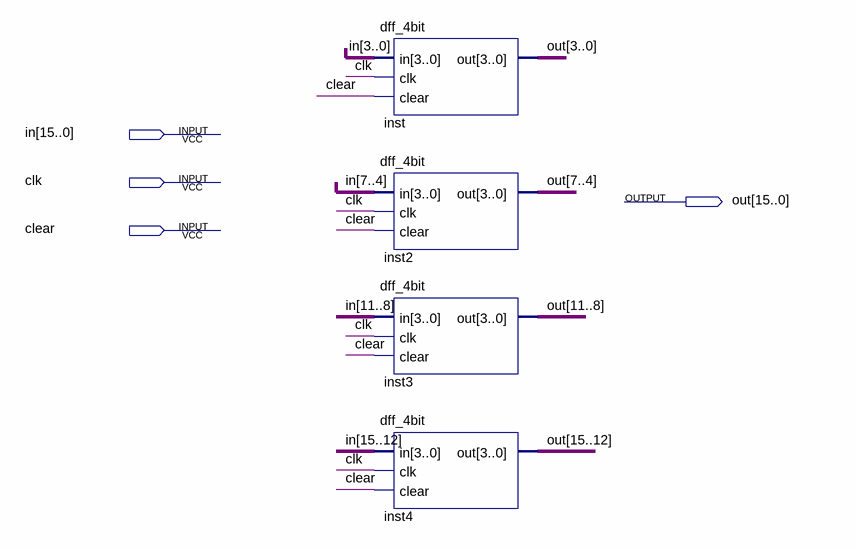
[diagram p0: schematic sheet]
// Quartus schematic dff_16bit.bdf as structural Verilog: 4 symbols, 4 pins
module dff_16bit (
  input  [15:0] in,
  input  clk,
  input  clear,
  output [15:0] out
);

  dff_4bit inst (.in(in[3:0]), .clk(clk), .clear(clear), .out(out[3:0]));
  dff_4bit inst2 (.in(in[7:4]), .clk(clk), .clear(clear), .out(out[7:4]));
  dff_4bit inst3 (.in(in[11:8]), .clk(clk), .clear(clear), .out(out[11:8]));
  dff_4bit inst4 (.in(in[15:12]), .clk(clk), .clear(clear), .out(out[15:12]));
endmodule
